# EAGLE design pmod-qwiic (EAGLE 9.5.2)
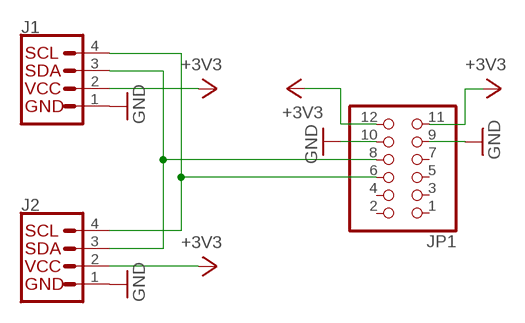
[diagram p0: schematic, sheet 1]

## Parts
J1  QWIIC_CONNECTORJS-1MM  [1X04_1MM_RA]
J2  QWIIC_CONNECTORJS-1MM  [1X04_1MM_RA]
JP1  PINHD-2X6/90  [2X06/90]

## Nets
+3V3: J1.2(VCC) J2.2(VCC) JP1.11 JP1.12
GND: J1.1(GND) J2.1(GND) JP1.9 JP1.10
N$1: J1.3(SDA) J2.3(SDA) JP1.8
N$2: J1.4(SCL) J2.4(SCL) JP1.6
Unconnected: JP1.1 JP1.2 JP1.3 JP1.4 JP1.5 JP1.7

## Library data of the parts
J1 J2 = SparkFun-Connectors:QWIIC_CONNECTOR: SparkFun I2C Standard Qwiic Connector An SMD 1mm pitch JST connector makes it easy and quick (get it? Qwiic?) to connect I2C devices to each other. The Qwiic system <http://www.sparkfun.com/qwiic> enables fast and solderless connection between popular platforms and various sensors and actuators. We carry 200mm <https://www.sparkfun.com/products/14204>, 100mm <https://www.sparkfun.com/products/14205>, 50mm <https://www.sparkfun.com/products/14206>, and breadboard friendly <https://www.sparkfun.com/products/14207> Qwiic cables. We also offer 10 pcs strips <https://www.sparkfun.com/products/14323> the SMD connectors.
JP1 = pinhead:PINHD-2X6: PIN HEADER

## Board
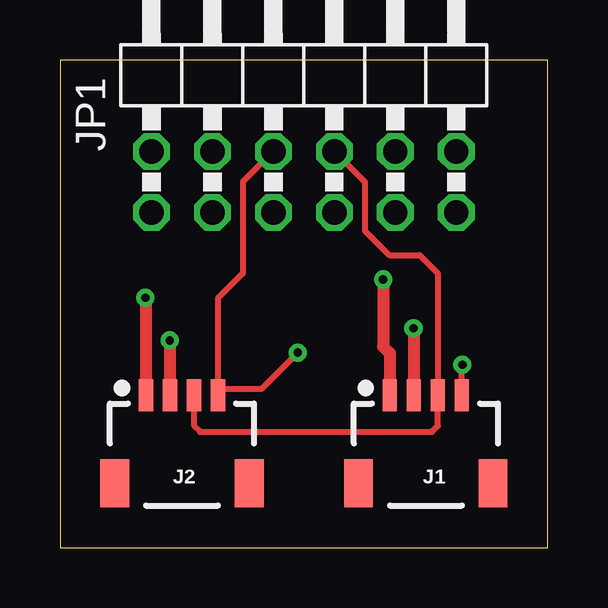
[diagram p1: board, top side]
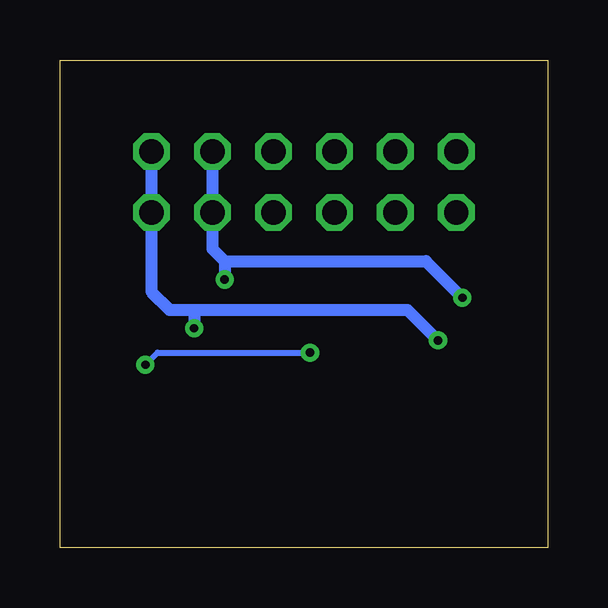
[diagram p2: board, bottom side, seen from below]

Size 20.32 x 20.32 mm. Coordinates in mm from the lower left corner, seen from the top.
Outline: 0,0 20.32,0 20.32,20.32 0,20.32 0,0
Copper layers (1*16): Top 0.035mm / dielectric 1.5mm / Bottom 0.035mm
Design rules "default": minimum track width 6mil, minimum drill 0.35mm, track to track 6mil, track to pad 6mil, pad to pad 6mil, via to via 6mil, smd to smd 6mil, copper to edge 40mil, drill to drill 6mil, minimum pad ring 10mil, minimum via ring 8mil, stop-mask expansion 4mil, vias tented up to drill 0mil, thermal gap 10mil

### Footprints (pad centres in the part's own frame; a part is rotated, then mirrored left to right if it is on the bottom)
1X04_1MM_RA = smd 0.6 x 1.35: 1 -1.5,0; 2 -0.5,0; 3 0.5,0; 4 1.5,0 | smd 1.2 x 2: NC1 2.8,-3.675; NC2 -2.8,-3.675
2X06/90 = drill 1.016 octagon: 1 -6.35,-6.35; 2 -6.35,-3.81; 3 -3.81,-6.35; 4 -3.81,-3.81; 5 -1.27,-6.35; 6 -1.27,-3.81; 7 1.27,-6.35; 8 1.27,-3.81; 9 3.81,-6.35; 10 3.81,-3.81; 11 6.35,-6.35; 12 6.35,-3.81

### Placement (x,y rotation side)
J1  15.24,6.35 0 top
J2  5.08,6.35 0 top
JP1  10.16,20.32 0 top

### Tracks (layer width: path | path; a pad name or v marks a point on that pad's centre or on a via)
+3V3  (via drill 0.35)
  Top 0.508: v4.57,8.64 4.58,8.63 J2.2 | v14.73,9.14 v14.74,9.14 J1.2
  Bottom 0.508: JP1.12 JP1.11 16.51,10.67 15.75,9.91 14.73,9.91 | v4.57,8.64 5.84,9.91 14.73,9.91 | 14.73,9.91 v14.73,9.14
GND  (via drill 0.35)
  Top 0.508: v3.56,10.41 3.58,10.39 J2.1 | J1.1 13.74,8.1 13.46,8.38 v13.46,11.18
  Bottom 0.508: JP1.10 JP1.9 13.97,12.45 13.46,11.94 | v3.56,10.41 5.08,11.94 13.46,11.94 | 13.46,11.94 v13.46,11.18
N$1
  Top 0.254: JP1.8 12.7,15.24 12.7,13.21 13.72,12.19 14.99,12.19 15.75,11.43 J1.3 15.75,5.08 15.49,4.83 5.84,4.83 5.58,5.09 J2.3
N$2  (via drill 0.35)
  Top 0.254: JP1.6 7.62,15.24 7.62,11.43 6.58,10.39 6.58,6.6 | 6.58,6.6 J2.4 | J1.4 16.74,7.6 v16.76,7.62 | v9.91,8.13 8.38,6.6 6.58,6.6
  Bottom 0.254: v16.76,7.62 16.26,8.13 v9.91,8.13